# EAGLE schematic Main Board (EAGLE 7.7.0)
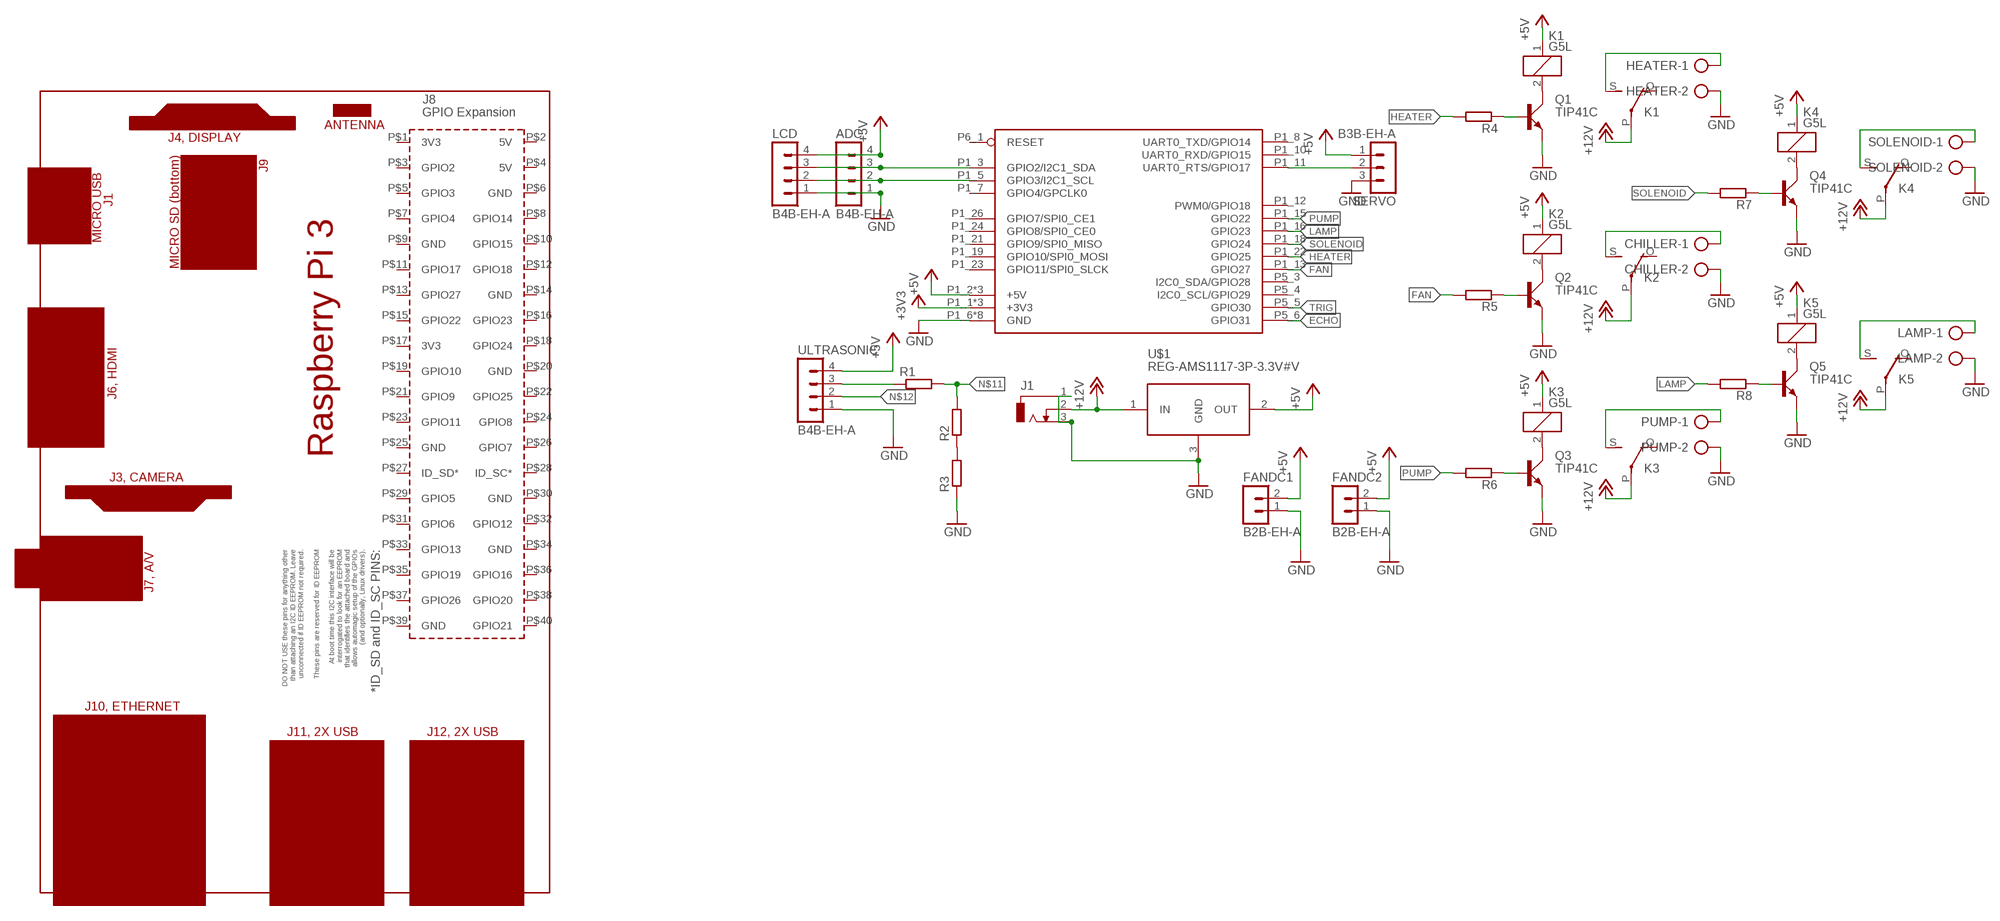
[diagram p0: schematic, sheet 1]

## Parts
ADC  B4B-EH-A  [B4B-EH-A]
CHILLER  AK500/2-H  [AK500/2-H]
FANDC1  B2B-EH-A  [B2B-EH-A]
FANDC2  B2B-EH-A  [B2B-EH-A]
HEATER  AK500/2-H  [AK500/2-H]
J1  DCJ0303  [DCJ0303]
K1  G5L  [G5LE]
K2  G5L  [G5LE]
K3  G5L  [G5LE]
K4  G5L  [G5LE]
K5  G5L  [G5LE]
LAMP  AK500/2-H  [AK500/2-H]
LCD  B4B-EH-A  [B4B-EH-A]
PCB1  RPI3  [RPI3]
PUMP  AK500/2-H  [AK500/2-H]
Q1  TIP41C  [TO220AV]
Q2  TIP41C  [TO220AV]
Q3  TIP41C  [TO220AV]
Q4  TIP41C  [TO220AV]
Q5  TIP41C  [TO220AV]
R1  R-EU_0207/15  [0207/15]
R2  R-EU_0207/15  [0207/15]
R3  R-EU_0207/15  [0207/15]
R4  R-EU_0207/15  [0207/15]
R5  R-EU_0207/15  [0207/15]
R6  R-EU_0207/15  [0207/15]
R7  R-EU_0207/15  [0207/15]
R8  R-EU_0207/15  [0207/15]
SERVO  B3B-EH-A  [B3B-EH-A]
SOLENOID  AK500/2-H  [AK500/2-H]
U$1  REG-AMS1117-3P-3.3V#V  [REG-AMS1117-3P#V]
U$3  RPI-B-V2NO_SHIELD  [RPI-B-V2]
ULTRASONIC  B4B-EH-A  [B4B-EH-A]

## Nets
+3V3: U$3.P1_1(+3V3) U$3.P1_17(+3V3) U$3.P5_2(+3V3)
+5V: ADC.4 FANDC1.2 FANDC2.2 K1.1 K2.1 K3.1 K4.1 K5.1 LCD.4 SERVO.1 U$1.2(OUT) U$3.P1_2(+5V) U$3.P1_4(+5V) U$3.P5_1(+5V) ULTRASONIC.4
+12V: J1.2 K1.P(2:P) K2.P(2:P) K3.P(2:P) K4.P(2:P) K5.P(2:P) U$1.1(IN)
ECHO: U$3.P5_6(GPIO31)
FAN: R5.2 U$3.P1_13(GPIO27)
GND: ADC.1 CHILLER.2 FANDC1.1 FANDC2.1 HEATER.2 J1.1 J1.3 LAMP.2 LCD.1 PUMP.2 Q1.E Q2.E Q3.E Q4.E Q5.E R3.1 SERVO.3 SOLENOID.2 U$1.3(GND) U$3.P1_6(GND) U$3.P1_9(GND) U$3.P1_14(GND) U$3.P1_20(GND) U$3.P1_25(GND) U$3.P5_7(GND) U$3.P5_8(GND) U$3.P6_2(GND) ULTRASONIC.1
HEATER: R4.2 U$3.P1_22(GPIO25)
LAMP: R8.2 U$3.P1_16(GPIO23)
N$1: ADC.3 LCD.3 U$3.P1_3(GPIO2/I2C1_SDA)
N$2: ADC.2 LCD.2 U$3.P1_5(GPIO3/I2C1_SCL)
N$3: K3.S(2:S) PUMP.1
N$4: K3.2 Q3.C
N$5: Q3.B R6.1
N$6: CHILLER.1 K2.S(2:S)
N$7: HEATER.1 K1.S(2:S)
N$8: SERVO.2 U$3.P1_11(UART0_RTS/GPIO17)
N$9: R2.1 R3.2
N$10: R1.1 ULTRASONIC.3
N$11: R1.2 R2.2
N$12: ULTRASONIC.2
N$13: K1.2 Q1.C
N$14: Q1.B R4.1
N$15: K2.2 Q2.C
N$16: Q2.B R5.1
N$18: K4.S(2:S) SOLENOID.1
N$19: K4.2 Q4.C
N$20: Q4.B R7.1
N$21: K5.S(2:S) LAMP.1
N$22: K5.2 Q5.C
N$23: Q5.B R8.1
PUMP: R6.2 U$3.P1_15(GPIO22)
SOLENOID: R7.2 U$3.P1_18(GPIO24)
TRIG: U$3.P5_5(GPIO30)
Unconnected: K1.O(2:O) K2.O(2:O) K3.O(2:O) K4.O(2:O) K5.O(2:O) PCB1.P$1(3V3) PCB1.P$2(5V) PCB1.P$3(GPIO2) PCB1.P$4(5V) PCB1.P$5(GPIO3) PCB1.P$6(GND) PCB1.P$7(GPIO4) PCB1.P$8(GPIO14) PCB1.P$9(GND) PCB1.P$10(GPIO15) PCB1.P$11(GPIO17) PCB1.P$12(GPIO18) PCB1.P$13(GPIO27) PCB1.P$14(GND) PCB1.P$15(GPIO22) PCB1.P$16(GPIO23) PCB1.P$17(3V3) PCB1.P$18(GPIO24) PCB1.P$19(GPIO10) PCB1.P$20(GND) PCB1.P$21(GPIO9) PCB1.P$22(GPIO25) PCB1.P$23(GPIO11) PCB1.P$24(GPIO8) PCB1.P$25(GND) PCB1.P$26(GPIO7) PCB1.P$27(ID_SD*) PCB1.P$28(ID_SC*) PCB1.P$29(GPIO5) PCB1.P$30(GND) PCB1.P$31(GPIO6) PCB1.P$32(GPIO12) PCB1.P$33(GPIO13) PCB1.P$34(GND) PCB1.P$35(GPIO19) PCB1.P$36(GPIO16) PCB1.P$37(GPIO26) PCB1.P$38(GPIO20) PCB1.P$39(GND) PCB1.P$40(GPIO21) U$3.P1_7(GPIO4/GPCLK0) U$3.P1_8(UART0_TXD/GPIO14) U$3.P1_10(UART0_RXD/GPIO15) U$3.P1_12(PWM0/GPIO18) U$3.P1_19(GPIO10/SPI0_MOSI) U$3.P1_21(GPIO9/SPI0_MISO) U$3.P1_23(GPIO11/SPI0_SLCK) U$3.P1_24(GPIO8/SPI0_CE0) U$3.P1_26(GPIO7/SPI0_CE1)

## Power pins joined to a net without a drawn wire
I2C0_SCL/GPIO29: U$3.P5_4(I2C0_SCL/GPIO29)
I2C0_SDA/GPIO28: U$3.P5_3(I2C0_SDA/GPIO28)
RESET: U$3.P6_1(RESET)

## Library data of the parts
ADC LCD ULTRASONIC = con-JST EH:B4B-EH: JST EH series header 2.50mm pitch disconnectable crimp style connectors, vertical (side entry type), 4 pins
CHILLER HEATER LAMP PUMP SOLENOID = con-ptr500:AK500/2-H: CONNECTOR Aug. 2004 / PTR Meßtechnik: Die Bezeichnung der Serie AK505 wurde geändert. Es handelt sich hierbei um AK500 in horizontaler Ausführung.; OC_FARNELL: unknown; OC_NEWARK: unknown
FANDC1 FANDC2 = con-JST EH:B2B-EH: JST EH series header 2.50mm pitch disconnectable crimp style connectors, vertical (side entry type), 2 pins
J1 = con-jack:DCJ0303: DC POWER JACK Source: DCJ0303.pdf; OC_FARNELL: unknown; OC_NEWARK: unknown
K1-K5 = relay:G5L: RELAY 1 x switch, 10 A/120 V AC, 8 A/30 V ADC, Omron; OC_FARNELL: unknown; OC_NEWARK: unknown
PCB1 = e14_Rpi3_RevA:RPI3: Device for Raspberry Pi 3 board created by Dave Young for www.element14.com More information and support community is available at https://www.element14.com/community/community/raspberry-pi
Q1-Q5 = transistor-power:TIP41C: NPN TRANSISTOR
R1-R8 = rcl:R-EU_: RESISTOR, European symbol
SERVO = con-JST EH:B3B-EH: JST EH series header 2.50mm pitch disconnectable crimp style connectors, vertical (side entry type), 3 pins
U$1 = diy-modules:REG-AMS1117-3P-*: Linear Regulator based on AMS1117 chip 3-pin version AMS1117 datasheet is available here: http://www.advanced-monolithic.com/pdf/ds1117.pdf Click here to find device on ebay.com <http://www.ebay.com/sch/ams1117+module> Note: There are many variants. Search for the proper version.
U$3 = raspberrypi:RPI-B-V2: Second revision of the Model 2 board including the P5 and P6 headers. Mounting holes have been added. Choose the "SHIELD" variant for a predefined Dimension layer and drilling holes. Theres also a "SHIELD" variant for the Model A without a RJ45 connector.